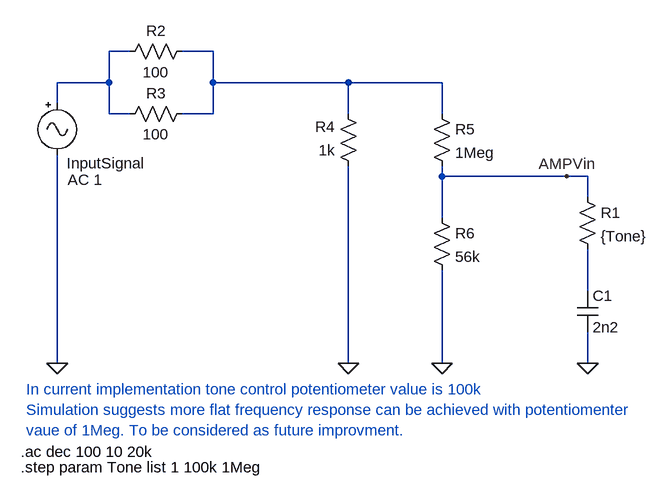
[diagram p0: schematic ToneControl LTSpice.asc]
ToneControl LTSpice.asc, the LTspice schematic file:
Version 4
SHEET 1 920 680
WIRE -704 -1536 -736 -1536
WIRE -576 -1536 -624 -1536
WIRE -736 -1488 -736 -1536
WIRE -736 -1488 -816 -1488
WIRE -576 -1488 -576 -1536
WIRE -368 -1488 -576 -1488
WIRE -224 -1488 -368 -1488
WIRE -816 -1456 -816 -1488
WIRE -736 -1440 -736 -1488
WIRE -704 -1440 -736 -1440
WIRE -576 -1440 -576 -1488
WIRE -576 -1440 -624 -1440
WIRE -368 -1440 -368 -1488
WIRE -224 -1440 -224 -1488
WIRE -224 -1344 -224 -1360
WIRE -32 -1344 -224 -1344
WIRE 0 -1344 -32 -1344
WIRE 0 -1312 0 -1344
WIRE -224 -1280 -224 -1344
WIRE 0 -1168 0 -1232
WIRE -816 -1056 -816 -1376
WIRE -368 -1056 -368 -1360
WIRE -224 -1056 -224 -1200
WIRE 0 -1056 0 -1104
FLAG -816 -1056 0
FLAG -368 -1056 0
FLAG -224 -1056 0
FLAG 0 -1056 0
FLAG -32 -1344 AMPVin
SYMBOL Misc\\signal -816 -1472 R0
WINDOW 123 16 133 Left 2
WINDOW 39 0 0 Left 0
WINDOW 0 15 108 Left 2
SYMATTR Value2 AC 1
SYMATTR InstName InputSignal
SYMATTR Value ""
SYMBOL res -16 -1328 R0
SYMATTR InstName R1
SYMATTR Value {Tone}
SYMBOL res -608 -1552 R90
WINDOW 0 0 56 VBottom 2
WINDOW 3 32 56 VTop 2
SYMATTR InstName R2
SYMATTR Value 100
SYMBOL res -608 -1456 R90
WINDOW 0 0 56 VBottom 2
WINDOW 3 32 56 VTop 2
SYMATTR InstName R3
SYMATTR Value 100
SYMBOL res -352 -1344 R180
WINDOW 0 36 76 Left 2
WINDOW 3 36 40 Left 2
SYMATTR InstName R4
SYMATTR Value 1k
SYMBOL res -240 -1456 R0
SYMATTR InstName R5
SYMATTR Value 1Meg
SYMBOL res -240 -1296 R0
SYMATTR InstName R6
SYMATTR Value 56k
SYMBOL cap -16 -1168 R0
SYMATTR InstName C1
SYMATTR Value 2n2
TEXT -872 -920 Left 2 !.ac dec 100 10 20k
TEXT -872 -896 Left 2 !.step param Tone list 1 100k 1Meg
TEXT -864 -1016 Left 2 ;In current implementation tone control potentiometer value is 100k\nSimulation suggests more flat frequency response can be achieved with potentiomenter\nvaue of 1Meg. To be considered as future improvment.

The netlist it stands for:
* ToneControl LTSpice.asc
V§InputSignal N001 0 AC 1
R1 AMPVin N003 {Tone}
R2 N002 N001 100
R3 N002 N001 100
R4 0 N002 1k
R5 N002 AMPVin 1Meg
R6 AMPVin 0 56k
C1 N003 0 2n2
.ac dec 100 10 20k
.step param Tone list 1 100k 1Meg
* In current implementation tone control potentiometer value is 100k
* Simulation suggests more flat frequency response can be achieved with potentiomenter
* vaue of 1Meg. To be considered as future improvment.
.backanno
.end